# EAGLE board ESP32-P4 Display 10.1 inch V1.1 (EAGLE 9.6.2), part 1 of 4
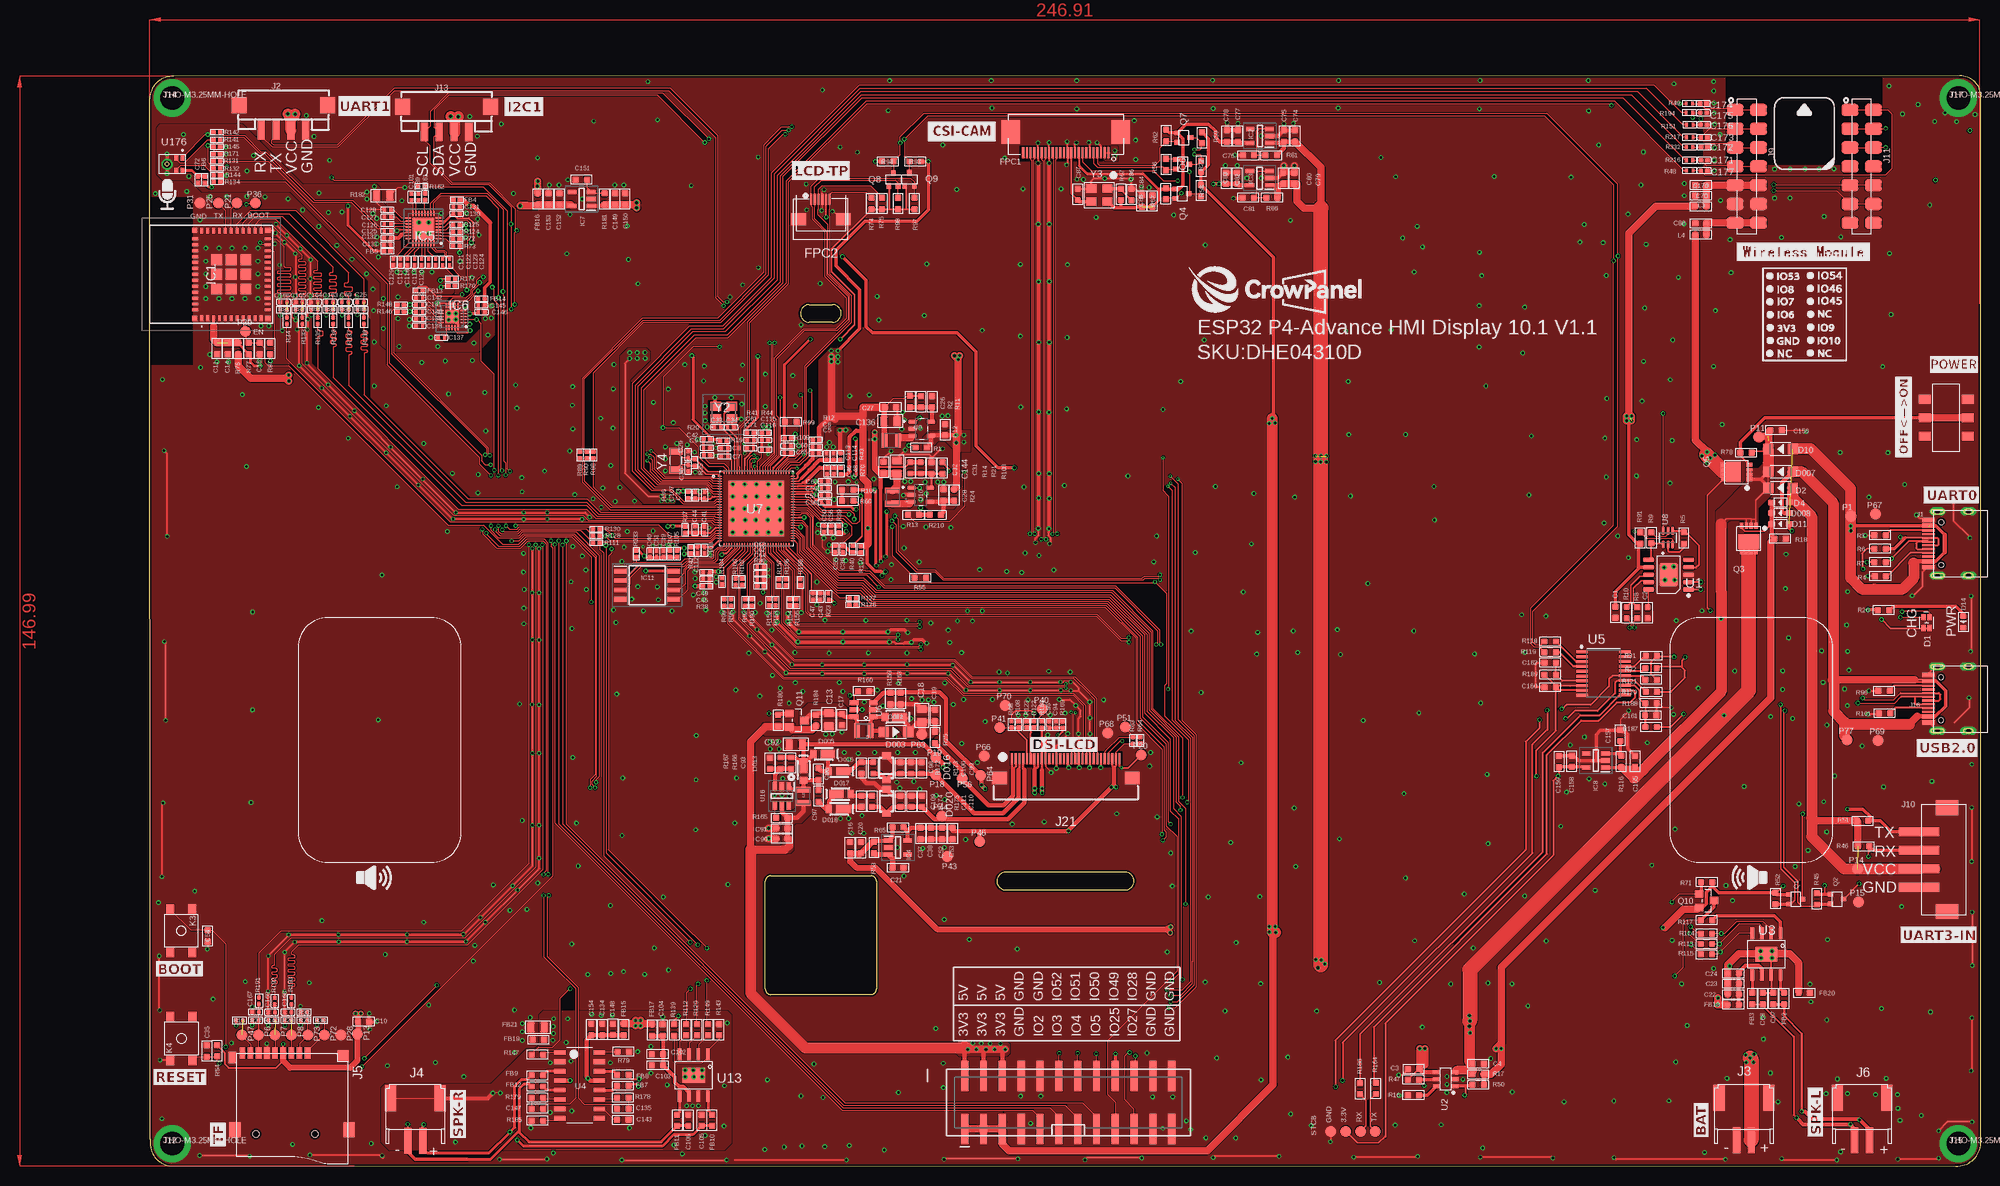
[diagram p10: board, top side]
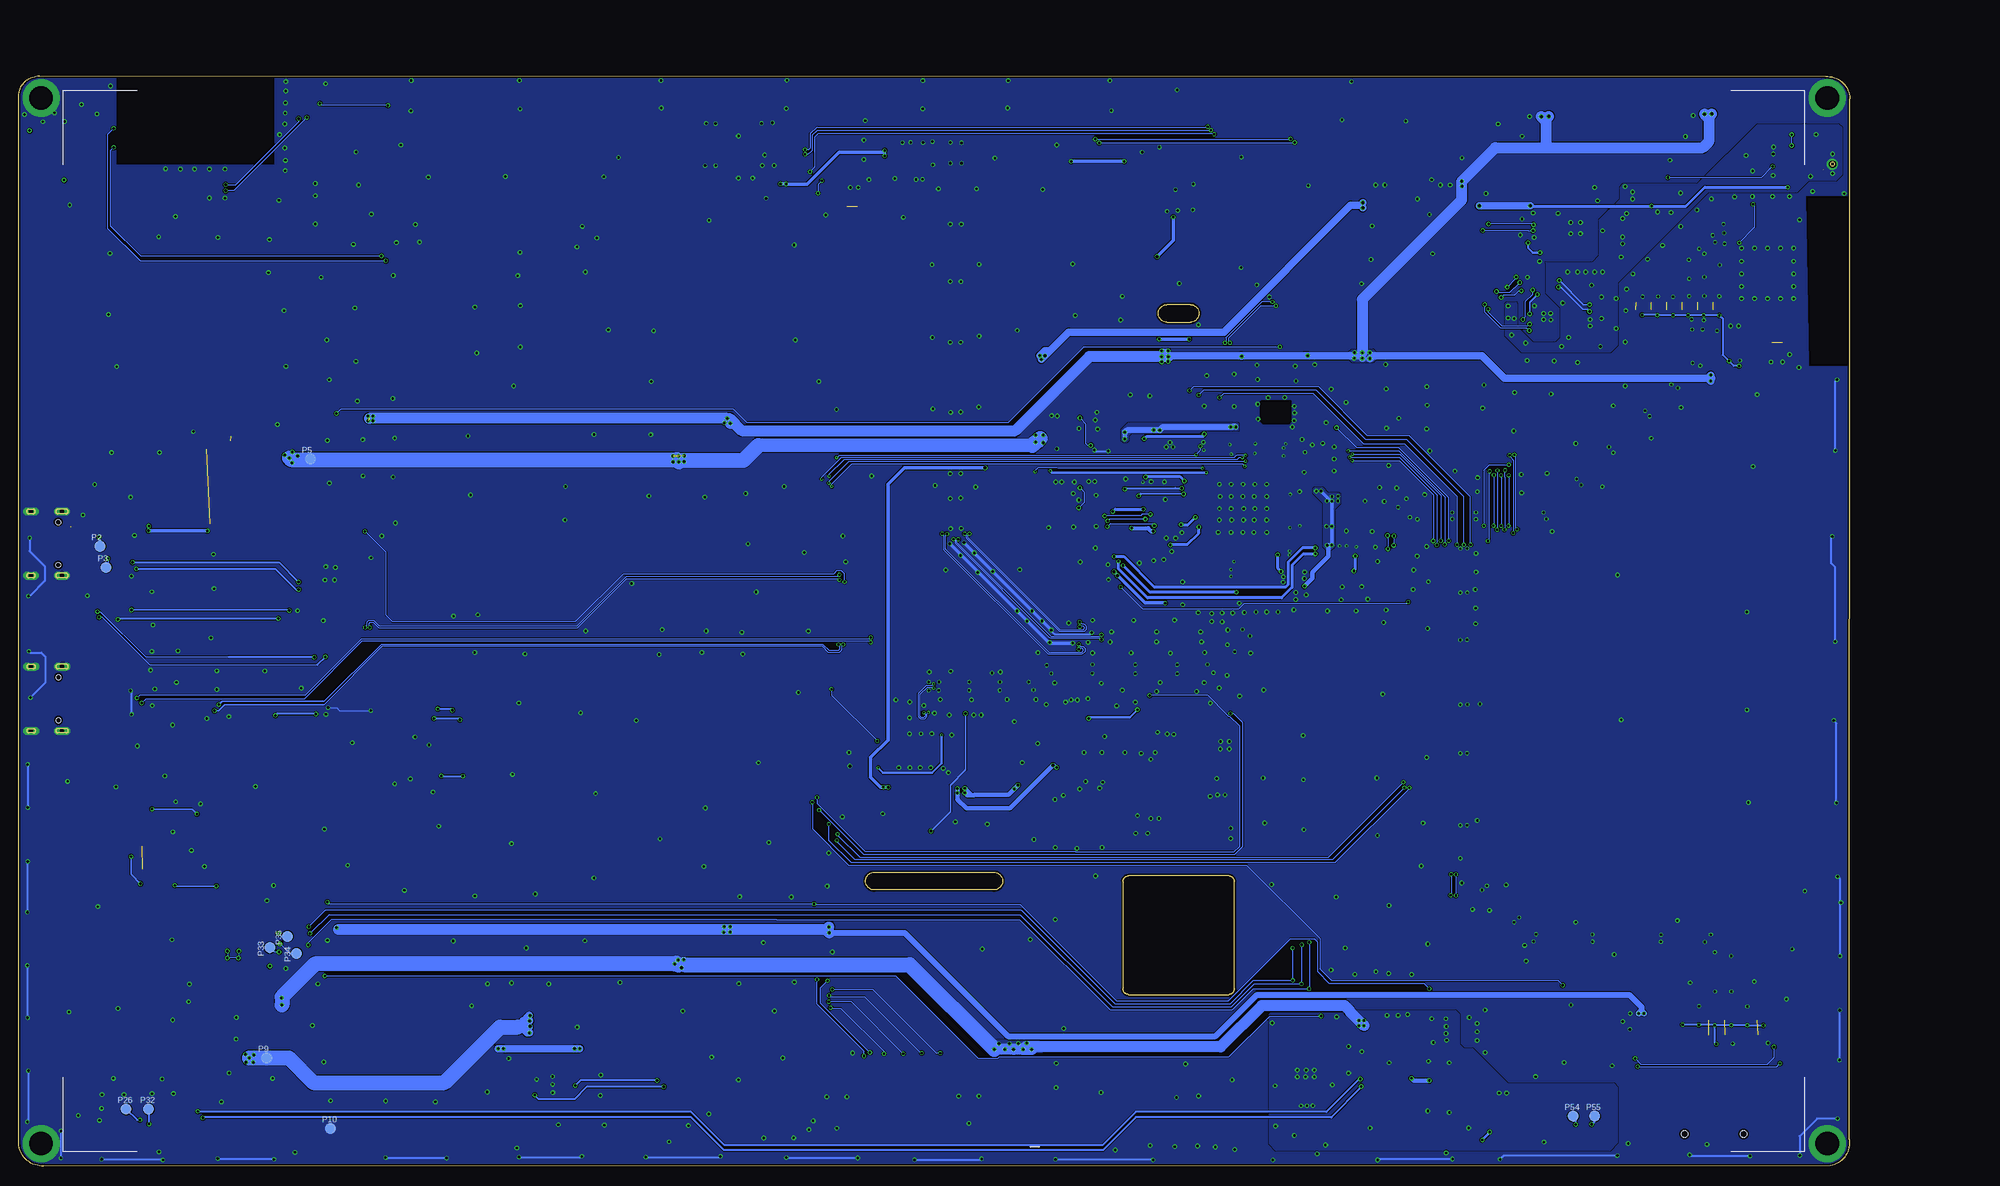
[diagram p11: board, bottom side, seen from below]

Size 247.04 x 147.01 mm. Coordinates in mm from the lower left corner, seen from the top.
Outline: 0.11,3.64 0,143.96 arc-90 3.28,146.96 244.18,147.01 arc-90 247.04,144.29 247.04,3.06 arc-90 243.64,0 2.67,0.03 arc-90 0.11,3.64
Outline: 115.49,37.24 131.61,37.24 arc180 131.61,39.62 115.49,39.62 arc180 115.49,37.24
Outline: 97.3,23.13 83.8,23.13 arc-90 83.05,23.88 83.05,38.38 arc-90 83.8,39.13 97.3,39.13 arc-90 98.05,38.38 98.05,23.88 arc-90 97.3,23.13
Outline: 92.11,113.8 88.99,113.8 arc-180 88.99,116.18 92.11,116.18 arc-180 92.11,113.8
Outline: circle at 2.38,135.11 radius 0.25
Copper layers (1*16): Top 0.035mm / dielectric 1.5mm / Bottom 0.035mm
Design rules "default *": minimum track width 4mil, minimum drill 0.2mm, track to track 4mil, track to pad 5mil, pad to pad 5mil, via to via 5mil, smd to smd 5mil, copper to edge 10mil, drill to drill 5mil, minimum pad ring 10mil, minimum via ring 4mil, stop-mask expansion 4mil, vias tented up to drill 30mil, thermal gap 6mil

## Footprints (pad centres in the part's own frame; a part is rotated, then mirrored left to right if it is on the bottom)
0603 = smd 0.889 x 0.889: 1 -0.762,0; 2 0.762,0
C0402 = smd 0.6 x 0.6: 1 -0.45,0; 2 0.45,0
C0805 = smd 1.016 x 1.397: 1 -0.889,0; 2 0.889,0
C0402' = smd 0.584 x 0.584: 1 -0.45,0; 2 0.45,0
0805 = smd 1.016 x 1.397: 1 -0.889,0; 2 0.889,0
C0402'' = smd 0.635 x 0.635: 1 0,0.445; 2 0,-0.445
LED_KT-0603RYG = smd 0.85 x 0.6: 1 0.725,-0.425; 2 0.725,0.425; 3 -0.725,-0.425; 4 -0.725,0.425
D_SOD123FL = smd 1.397 x 1.397: + -1.651,0; - 1.651,0
D_SOD323 = smd 1 x 0.8: + -1.2,0; - 1.2,0
LMBR140ET1G = smd 2 x 1.1: 1 -0.975,0 | smd 0.9 x 1.1: 2 0.975,0
LED0603 = smd 0.762 x 0.889: + -0.762,0; - 0.762,0
LMSZ5233BT1G = smd 0.91 x 1.22: 1 -1.635,0; 2 1.635,0
L0603 = smd 0.889 x 0.889: 1 -0.762,0; 2 0.762,0
L0402 = smd 0.635 x 0.635: 1 -0.445,0; 2 0.445,0
R0402 = smd 0.635 x 0.635: 1 -0.445,0; 2 0.445,0
L0805 = smd 1.016 x 1.397: 1 -0.889,0; 2 0.889,0
FPC-SMD_P0.50-24P_QCHF-SM-H2.0 = smd 0.3 x 1.5: 1 5.75,-1.574; 2 5.25,-1.574; 3 4.75,-1.574; 4 4.25,-1.574; 5 3.75,-1.574; 6 3.25,-1.574; 7 2.75,-1.574; 8 2.25,-1.574; 9 1.75,-1.574; 10 1.25,-1.574; 11 0.75,-1.574; 12 0.25,-1.574; 13 -0.25,-1.574; 14 -0.75,-1.574; 15 -1.25,-1.574; 16 -1.75,-1.574; 17 -2.25,-1.574; 18 -2.75,-1.574; 19 -3.25,-1.574; 20 -3.75,-1.574; 21 -4.25,-1.574; 22 -4.75,-1.574; 23 -5.25,-1.574; 24 -5.75,-1.574 | smd 2.5 x 3.2: 25 7.4,1.195; 26 -7.4,1.195
FPC-6PIN-0.5MM = smd 0.3 x 1.5: 1 -1.31,2.184; 2 -0.81,2.184; 3 -0.31,2.184; 4 0.19,2.184; 5 0.69,2.184; 6 1.19,2.184 | smd 2 x 1.6: 7 -3.01,-0.496; 8 3.036,-0.496
ESP32C6MINI1N4 = smd 0.8 x 0.4: 1 -5.9,4; 2 -5.9,3.2; 3 -5.9,2.4; 4 -5.9,1.6; 5 -5.9,0.8; 6 -5.9,0; 7 -5.9,-0.8; 8 -5.9,-1.6; 9 -5.9,-2.4; 10 -5.9,-3.2; 11 -5.9,-4; 25 5.9,-4; 26 5.9,-3.2; 27 5.9,-2.4; 28 5.9,-1.6; 29 5.9,-0.8; 30 5.9,0; 31 5.9,0.8; 32 5.9,1.6; 33 5.9,2.4; 34 5.9,3.2; 35 5.9,4 | smd 0.4 x 0.8: 12 -4.8,-4.9; 13 -4,-4.9; 14 -3.2,-4.9; 15 -2.4,-4.9; 16 -1.6,-4.9; 17 -0.8,-4.9; 18 0,-4.9; 19 0.8,-4.9; 20 1.6,-4.9; 21 2.4,-4.9; 22 3.2,-4.9; 23 4,-4.9; 24 4.8,-4.9; 36 4.8,4.9; 37 4,4.9; 38 3.2,4.9; 39 2.4,4.9; 40 1.6,4.9; 41 0.8,4.9; 42 0,4.9; 43 -0.8,4.9; 44 -1.6,4.9; 45 -2.4,4.9; 46 -3.2,4.9; 47 -4,4.9; 48 -4.8,4.9 | smd 1.45 x 1.45: 49 0,0; 54 -1.975,1.975; 55 -1.975,0; 56 -1.975,-1.975; 57 0,-1.975; 58 1.975,-1.975; 59 1.975,0; 60 1.975,1.975; 61 0,1.975 | smd 0.7 x 0.7: 50 5.95,4.95; 51 5.95,-4.95; 52 -5.95,-4.95; 53 -5.95,4.95
SOT95P282X145-5N = smd 1.2 x 0.6: 1 -1.3,0.95; 2 -1.3,0; 3 -1.3,-0.95; 4 1.3,-0.95; 5 1.3,0.95
QFN40P400X400X80-33N = smd 0.75 x 0.2: 1 -2,1.4; 2 -2,1; 3 -2,0.6; 4 -2,0.2; 5 -2,-0.2; 6 -2,-0.6; 7 -2,-1; 8 -2,-1.4; 17 2,-1.4; 18 2,-1; 19 2,-0.6; 20 2,-0.2; 21 2,0.2; 22 2,0.6; 23 2,1; 24 2,1.4 | smd 0.2 x 0.75: 9 -1.4,-2; 10 -1,-2; 11 -0.6,-2; 12 -0.2,-2; 13 0.2,-2; 14 0.6,-2; 15 1,-2; 16 1.4,-2; 25 1.4,2; 26 1,2; 27 0.6,2; 28 0.2,2; 29 -0.2,2; 30 -0.6,2; 31 -1,2; 32 -1.4,2 | smd 2.9 x 2.9: 33 0,0
QFN40P300X300X60-21N = smd 0.75 x 0.2: 1 -1.5,0.8; 2 -1.5,0.4; 3 -1.5,0; 4 -1.5,-0.4; 5 -1.5,-0.8; 11 1.5,-0.8; 12 1.5,-0.4; 13 1.5,0; 14 1.5,0.4; 15 1.5,0.8 | smd 0.2 x 0.75: 6 -0.8,-1.5; 7 -0.4,-1.5; 8 0,-1.5; 9 0.4,-1.5; 10 0.8,-1.5; 16 0.8,1.5; 17 0.4,1.5; 18 0,1.5; 19 -0.4,1.5; 20 -0.8,1.5 | smd 1.8 x 1.8: 21 0,0
SOIC127P790X216-8N = smd 1.65 x 0.65: 1 -3.6,1.905; 2 -3.6,0.635; 3 -3.6,-0.635; 4 -3.6,-1.905; 5 3.6,-1.905; 6 3.6,-0.635; 7 3.6,0.635; 8 3.6,1.905
USB-3.0TYPEC-SMD = smd 0.3 x 1.7: A1 -3.35,0.5; A4 -2.55,0.5; A5 -1.25,0.5; A6 -0.25,0.5; A7 0.25,0.5; A8 1.25,0.5; A9 2.55,0.5; A12 3.35,0.5; B1 3.05,0.5; B4 2.25,0.5; B5 1.75,0.5; B6 0.75,0.5; B7 -0.75,0.5; B8 -1.75,0.5; B9 -2.25,0.5; B12 -3.05,0.5 | drill 0.6 pad 1.016 long: P$1 -4.325,-0.72; P$2 4.325,-0.72; P$3 -4.325,-4.9; P$4 4.325,-4.9 | hole 0.68: -2.89,-1.22; 2.89,-1.22
CONNECTOR_4P-SMD-2.0 = smd 0.965 x 2.54: 1 -3,0; 2 -1,0; 3 1,0; 4 3,0 | smd 2.032 x 2.184: SS1 -5.946,3.4; SS2 5.946,3.4
PH2.0WT-2PIN = smd 1 x 3.5: P$1 -1,0; P$2 1,0 | smd 1.5 x 3.5: P$3 -3.35,-5.7; P$4 3.35,-5.7
9P-SMD-W/-RING = smd 1.524 x 0.762: 1 0,4.4; 2 0,3.3; 3 0,2.2; 4 0,1.1; 5 0,0; 6 0,-1.1; 7 0,-2.2; 8 0,-3.3; 9 0,-4.4 | smd 1.524 x 1.016: G1 0.6,-5.746 | smd 2.032 x 1.524: G2 10.373,-5.4; G3 10.373,10 | smd 1.524 x 1.524: G4 0.392,9.181 | hole 0.889: 10.9,-2.6; 10.9,5.4
2X12-SMD1 = smd 4.14 x 0.991: 1 -3.569,13.97; 2 3.569,13.97; 3 -3.569,11.43; 4 3.569,11.43; 5 -3.569,8.89; 6 3.569,8.89; 7 -3.569,6.35; 8 3.569,6.35; 9 -3.569,3.81; 10 3.569,3.81; 11 -3.569,1.27; 12 3.569,1.27; 13 -3.569,-1.27; 14 3.569,-1.27; 15 -3.569,-3.81; 16 3.569,-3.81; 17 -3.569,-6.35; 18 3.569,-6.35; 19 -3.569,-8.89; 20 3.569,-8.89; 21 -3.569,-11.43; 22 3.569,-11.43; 23 -3.569,-13.97; 24 3.569,-13.97
TEST-PIN-4-2.0MM = smd 1.5 x 1.5: 1 -3,0; 2 -1,0; 3 1,0; 4 3,0
H7-2.54-18.28X2.5X5MM = smd 1.65 x 2.3: 1 -7.62,-1.58; 1-1 -7.62,1.58; 2 -5.08,-1.58; 2-2 -5.08,1.58; 3 -2.54,-1.58; 3-3 -2.54,1.58; 4 0,-1.58; 4-4 0,1.58; 5 2.54,-1.58; 5-5 2.54,1.58; 6 5.08,-1.58; 6-6 5.08,1.58; 7 7.62,-1.58; 7-7 7.62,1.58
XH2.54-4P-SMD = smd 1.2 x 5.5: 1 -3.75,-1.875; 2 -1.25,-1.875; 3 1.25,-1.875; 4 3.75,-1.875 | smd 2 x 3: 5 -7,1.875; 6 7,1.875
THO-M3.2*5MM-HOLE = drill 3.2 pad 5: P$1 0,0
C23398852_30P_0.5MM_下接_FC-05A30P11H20 = smd 0.3 x 1.5: 1 -7.25,1.3; 2 -6.75,1.3; 3 -6.25,1.3; 4 -5.75,1.3; 5 -5.25,1.3; 6 -4.75,1.3; 7 -4.25,1.3; 8 -3.75,1.3; 9 -3.25,1.3; 10 -2.75,1.3; 11 -2.25,1.3; 12 -1.75,1.3; 13 -1.25,1.3; 14 -0.75,1.3; 15 -0.25,1.3; 16 0.25,1.3; 17 0.75,1.3; 18 1.25,1.3; 19 1.75,1.3; 20 2.25,1.3; 21 2.75,1.3; 22 3.25,1.3; 23 3.75,1.3; 24 4.25,1.3; 25 4.75,1.3; 26 5.25,1.3; 27 5.75,1.3; 28 6.25,1.3; 29 6.75,1.3; 30 7.25,1.3 | smd 2 x 1.7: 31 8.95,-1.3; 32 -8.95,-1.3
KEY-4.5X4.5-SMD = smd 1.35 x 1.1: 1 -2.925,1.5; 2 -2.925,-1.5; 3 2.925,-1.5; 4 2.925,1.5
1008(2520) = smd 0.8 x 2: 1 -0.9,0; 2 0.9,0
TEST_PAD-1.5MM = smd 1.5 x 1.5: P$1 0,0
MOS_SOT323 = smd 0.635 x 0.762: 1 -0.635,-0.889; 2 0.635,-0.889; 3 0,0.889
PDFN3333 = smd 0.5 x 0.8: 1 -0.975,-1.725; 2 -0.325,-1.725; 4 0.975,-1.725; 5 0.975,1.725; 6 0.325,1.725; 7 -0.325,1.725; 8 -0.975,1.725 | smd 0.4 x 0.8: 3 0.325,-1.725 | smd 2.8 x 2: 9 0,0.4
PMOS_SOT23 = smd 1.016 x 1.143: 1 -0.889,-1.016; 2 0.889,-1.016; 3 0,1.016
R0603@1 = smd 0.889 x 0.889: 1 -0.762,0; 2 0.762,0
R0603 = smd 0.889 x 0.889: 1 -0.762,0; 2 0.762,0
R0402' = smd 0.584 x 0.584: 1 -0.445,0; 2 0.445,0
R0603-SP = smd 0.889 x 0.889: 1 -0.762,0; 2 0.762,0
0402 = smd 0.5 x 0.5: 1 -0.45,0; 2 0.45,0
R0805 = smd 1.016 x 1.397: 1 -0.889,0; 2 0.889,0
SWITCH_6PIN_2P = smd 1.2 x 1.6: 1 2.5,-2.9; 2 0,-2.9; 3 -2.5,-2.9; 4 -2.5,2.9; 5 0,2.9; 6 2.5,2.9
ESOP-10-EP-150MIL = smd 1.5 x 0.6: 1 -2.7,2; 2 -2.7,1; 3 -2.7,0; 4 -2.7,-1; 5 -2.7,-2; 6 2.7,-2; 7 2.7,-1; 8 2.7,0; 9 2.7,1; 10 2.7,2 | smd 2.4 x 3.2: EP 0,0
SOT23-6L = smd 0.5 x 0.9: 1 -0.961,-1.212; 2 -0.011,-1.212; 3 0.94,-1.212; 4 0.94,1.288; 5 -0.011,1.288; 6 -0.961,1.288
NS4168-ESOP-8 = smd 1.6 x 0.5: 1 -2.8,1.905; 2 -2.8,0.635; 3 -2.8,-0.635; 4 -2.8,-1.905; 5 2.8,-1.905; 6 2.8,-0.635; 7 2.8,0.635; 8 2.8,1.905 | smd 2 x 3: 9 0,0
SOP16 = smd 0.635 x 1.524: 1 0,0; 2 1.27,0; 3 2.54,0; 4 3.81,0; 5 5.08,0; 6 6.35,0; 7 7.62,0; 8 8.89,0; 9 8.89,5.334; 10 7.62,5.334; 11 6.35,5.334; 12 5.08,5.334; 13 3.81,5.334; 14 2.54,5.334; 15 1.27,5.334; 16 0,5.334
TSSOP20 = smd 1.572 x 0.41: 1 -2.872,2.275; 2 -2.872,1.625; 3 -2.872,0.975; 4 -2.872,0.325; 5 -2.872,-0.325; 6 -2.872,-0.975; 7 -2.872,-1.625; 8 -2.872,-2.275; 9 -2.872,-2.895; 10 -2.872,-3.545; 11 2.872,-3.515; 12 2.872,-2.865; 13 2.872,-2.215; 14 2.872,-1.565; 15 2.872,-0.915; 16 2.872,-0.265; 17 2.872,0.355; 18 2.872,1.005; 19 2.872,1.625; 20 2.872,2.275
COOPER_SOT23-6 = smd 0.69 x 1.2: 1 -0.95,-1.3; 2 0,-1.3; 3 0.95,-1.3; 4 0.95,1.3; 5 0,1.3; 6 -0.95,1.3
IC_ESP32-P4NRW32 = smd 0.65 x 0.18: 1 -4.925,4.375; 2 -4.925,4.025; 3 -4.925,3.675; 4 -4.925,3.325; 5 -4.925,2.975; 6 -4.925,2.625; 7 -4.925,2.275; 8 -4.925,1.925; 9 -4.925,1.575; 10 -4.925,1.225; 11 -4.925,0.875; 12 -4.925,0.525; 13 -4.925,0.175; 14 -4.925,-0.175; 15 -4.925,-0.525; 16 -4.925,-0.875; 17 -4.925,-1.225; 18 -4.925,-1.575; 19 -4.925,-1.925; 20 -4.925,-2.275; 21 -4.925,-2.625; 22 -4.925,-2.975; 23 -4.925,-3.325; 24 -4.925,-3.675; 25 -4.925,-4.025; 26 -4.925,-4.375; 53 4.925,-4.375; 54 4.925,-4.025; 55 4.925,-3.675; 56 4.925,-3.325; 57 4.925,-2.975; 58 4.925,-2.625; 59 4.925,-2.275; 60 4.925,-1.925; 61 4.925,-1.575; 62 4.925,-1.225; 63 4.925,-0.875; 64 4.925,-0.525; 65 4.925,-0.175; 66 4.925,0.175; 67 4.925,0.525; 68 4.925,0.875; 69 4.925,1.225; 70 4.925,1.575; 71 4.925,1.925; 72 4.925,2.275; 73 4.925,2.625; 74 4.925,2.975; 75 4.925,3.325; 76 4.925,3.675; 77 4.925,4.025; 78 4.925,4.375 | smd 0.18 x 0.65: 27 -4.375,-4.925; 28 -4.025,-4.925; 29 -3.675,-4.925; 30 -3.325,-4.925; 31 -2.975,-4.925; 32 -2.625,-4.925; 33 -2.275,-4.925; 34 -1.925,-4.925; 35 -1.575,-4.925; 36 -1.225,-4.925; 37 -0.875,-4.925; 38 -0.525,-4.925; 39 -0.175,-4.925; 40 0.175,-4.925; 41 0.525,-4.925; 42 0.875,-4.925; 43 1.225,-4.925; 44 1.575,-4.925; 45 1.925,-4.925; 46 2.275,-4.925; 47 2.625,-4.925; 48 2.975,-4.925; 49 3.325,-4.925; 50 3.675,-4.925; 51 4.025,-4.925; 52 4.375,-4.925; 79 4.375,4.925; 80 4.025,4.925; 81 3.675,4.925; 82 3.325,4.925; 83 2.975,4.925; 84 2.625,4.925; 85 2.275,4.925; 86 1.925,4.925; 87 1.575,4.925; 88 1.225,4.925; 89 0.875,4.925; 90 0.525,4.925; 91 0.175,4.925; 92 -0.175,4.925; 93 -0.525,4.925; 94 -0.875,4.925; 95 -1.225,4.925; 96 -1.575,4.925; 97 -1.925,4.925; 98 -2.275,4.925; 99 -2.625,4.925; 100 -2.975,4.925; 101 -3.325,4.925; 102 -3.675,4.925; 103 -4.025,4.925; 104 -4.375,4.925 | smd 7.5 x 7.5: 105 0,0
SOP65P210X100-6N = smd 1.09 x 0.4: 1 -0.92,0.65; 2 -0.92,0; 3 -0.92,-0.65; 4 0.92,-0.65; 5 0.92,0; 6 0.92,0.65
SOT95P280X145-5N = smd 1.21 x 0.59: 1 -1.255,0.95; 2 -1.255,0; 3 -1.255,-0.95; 4 1.255,-0.95; 5 1.255,0.95
SOT95P280X145-6N = smd 1.2 x 0.6: 1 -1.25,0.95; 2 -1.25,0; 3 -1.25,-0.95; 4 1.25,-0.95; 5 1.25,0; 6 1.25,0.95
BRAIN1_MIC-SMD_5P-L3.5-W2.7 = smd 0.725 x 0.522: 1 -0.838,1.362; 2 -0.838,0.542; 3 0.838,0.542; 4 0.838,1.362 | drill 1: P$1 0.013,-0.711
X322540MPB4SI = smd 1.4 x 1.2: 1 -1.1,-0.85; 2 1.1,-0.85; 3 1.1,0.85; 4 -1.1,0.85
24MHZ_1631-24003-BTKEYA = smd 1.4 x 1.2: 1 -1.1,-0.875; 2 1.1,-0.875; 3 1.1,0.875; 4 -1.1,0.875
NORDIC_NRF_XTAL_3215_N = smd 1 x 1.8: 1 -1.25,0; 2 1.25,0

## Placement (x,y rotation side)
C1  1uF  [0603]  197.74,74.68 90 top
C2  1uF  [0603]  202.07,74.62 90 top
C3  1uF  [0603]  170.5,13.08 0 top
C4  10uF/NC  [0603]  179.2,13.79 180 top
C5  100nF  [C0402]  89.87,96.11 0 top
C6  10uF  [C0402]  89.88,97.01 180 top
C7  100nF  [C0402]  77.55,95.69 180 top
C8  10uF  [C0402]  77.55,96.78 0 top
C9  100nF  [C0402]  75.21,95.83 0 top
C10  1uF  [0603]  28.88,19.47 180 top
C11  100nF  [0603]  9.1,110.26 270 top
C12  10uF/10V+  [0603]  107.31,99.29 90 top
C13  22uF  [C0805]  91.64,60.2 270 top
C14  10uF  [0603]  10.53,110.26 90 top
C15  100nF  [0603]  14.83,110.26 270 top
C16  10uF  [0603]  94.48,42.94 270 top
C17  1uF  [0603]  93.39,60.2 90 top
C18  22uF  [C0805]  104.18,60.74 90 top
C19  100nF  [0603]  105.97,60.77 90 top
C20  100nF  [0603]  95.95,42.94 270 top
C21  100nF  [0603]  100.97,40.22 180 top
C22  1uF_NC  [0603]  213.62,23.16 180 top
C23  47uF_NC  [0603]  213.62,24.59 180 top
C24  47uF_NC  [0603]  213.62,25.99 180 top
C25  22pF  [C0402']  28.46,116.5 180 top
C26  22pF  [0603]  102.6,103.09 90 top
C27  10uF/10V+  [0603]  99.96,102.34 180 top
C28  10uF/10V+  [0603]  107.11,90.49 90 top
C29  12pF  [C0402]  72.64,95.94 90 top
C30  12pF  [C0402]  72.65,94.11 270 top
C31  22pF  [0603]  102.62,94.16 90 top
C32  10uF/10V+  [0603]  99.03,94.24 270 top
C33  15pF  [C0402]  76.59,99.63 180 top
C34  15pF  [C0402]  78.43,99.63 180 top
C35  100nF  [0603]  7.74,15.51 270 top
C36  100nF  [C0402]  93.52,83.18 270 top
C37  100nF  [0603]  104.01,44.85 90 top
C38  10uF  [0603]  105.44,44.85 90 top
C39  100nF_NC  [C0402]  69.29,82.57 90 top
C40  100nF  [C0402]  67.49,82.57 90 top
C41  100nF  [C0402]  74.87,85.82 90 top
C42  10uF  [C0402]  75.19,96.85 180 top
C43  100nF  [C0402]  90.5,76.81 270 top
C44  10uF  [C0402]  73.56,85.85 270 top
C45  100nF  [C0402]  75.11,79.17 180 top
C46  100nF  [C0402]  91.39,93.73 270 top
C47  10uF  [C0402]  89.5,76.8 90 top
C48  10uF  [C0402]  92.33,93.73 90 top
C49  10uF  [C0402]  75.11,80.09 0 top
C50  100nF  [C0402]  90.98,85.91 270 top
C51  1uF  [C0402]  68.39,82.57 90 top
C52  100nF  [0603]  106.89,44.85 90 top
C53  100nF  [0603]  108.32,44.85 90 top
C54  100nF  [0603]  7.83,31.03 90 top
C55  1uF  [C0402]  92.5,83.19 270 top
C56  10uF  [C0402]  91.98,85.91 90 top
C57  1uF  [C0402]  91.1,90.47 0 top
C58  1uF  [C0402]  91.1,89.51 0 top
C59  1uF  [C0402]  91.1,91.41 0 top
C60  100nF  [C0402]  86.08,97.12 0 top
C61  100nF  [C0402]  81.05,97.88 180 top
C62  10nF  [C0402]  82.41,79.92 0 top
C63  100nF  [C0402]  82.4,80.79 0 top
C64  1uF  [C0402]  82.39,79.09 0 top
C65  1uF  [C0402]  86.08,96.2 0 top
C66  1uF  [C0402]  91.1,92.33 0 top
C67  1nF  [0603]  219.03,22.59 270 top
C68  1nF  [0603]  217.61,22.59 270 top
C69  22pF  [C0402']  26.39,116.5 180 top
C70  10UF  [0603]  209.26,130.85 180 top
C71  10uF  [C0402]  81.03,96.79 0 top
C72  100nF  [C0402]  6.54,133 90 top
C73  100nF  [C0402]  74.87,90.5 90 top
C74  10uF  [0603]  154.52,138.92 270 top
C75  100nF  [0603]  153.05,138.92 270 top
C76  100nF  [0603]  148.23,136.3 0 top
C77  100nF  [0603]  146.81,138.92 270 top
C78  10uF  [0603]  145.32,138.92 270 top
C79  10uF  [0603]  154.42,133.22 270 top
C80  100nF  [0603]  152.91,133.22 270 top
C81  100nF  [0603]  148.2,130.6 0 top
C82  100nF  [0603]  146.72,133.22 270 top
C83  10uF  [0603]  145.22,133.22 270 top
C84  100nF  [0603]  133.85,130.13 270 top
C85  1nF  [0603]  135.28,130.16 270 top
C86  1uF  [0603]  132.46,131.03 270 top
C87  15pF  [0603]  125.2,131.04 270 top
C88  10UF_NC  [0603]  209.26,127.12 180 top
C89  22pF  [C0402]  36.27,130.7 90 top
C90  10uF/25V  [0603]  85.28,44.17 180 top
C91  100nF/50V  [0603]  85.28,45.55 180 top
C92  22uF/16V  [C0805]  87.17,56.88 180 top
C93  10nF/25V  [0603]  86.52,54.34 270 top
C94  10uF/25V  [C0402]  122.29,59.54 90 top
C95  100nF/50V  [C0402]  121.38,59.54 90 top
C96  1uF/25V  [0603]  90.23,52.86 90 top
C97  1uF/25V  [0603]  90.24,49.9 270 top
C98  1uF/50V  [0603]  96.02,53.7 270 top
C99  10uF/25V  [0603]  104.16,53.7 90 top
C100  100nF/50V  [0603]  102.74,53.7 90 top
C101  22pF  [C0402]  35.32,130.7 90 top
C102  1uF_NC  [0603]  68.52,15.09 180 top
C103  47uF_NC  [0603]  68.52,13.59 180 top
C104  47uF_NC  [0603]  69.21,18.36 90 top
C105  1nF  [0603]  74.47,6.18 270 top
C106  1nF  [0603]  72.68,6.18 270 top
C107  10uF  [C0402]  73.65,90.5 270 top
C108  100nF  [C0402]  74.87,83.04 270 top
C109  1uF/50V  [0603]  96.03,49.19 270 top
C110  10uF/25V  [0603]  104.2,49.19 90 top
C111  100nF/50V  [0603]  102.8,49.19 90 top
C112  10uF  [C0402]  73.92,83.04 90 top
C113  100nF  [C0402]  91.33,95.68 90 top
C114  10uF  [C0402]  92.26,95.68 270 top
C115  100nF  [C0402]  83.02,97.91 0 top
C116  10uF  [C0402]  83.03,96.63 180 top
C117  1uF  [C0402]  33.86,121.9 90 top
C118  1uF  [C0402]  34.81,121.9 90 top
C119  1uF  [C0402]  35.75,121.9 90 top
C120  1uF  [C0402]  36.7,121.9 90 top
C121  1uF  [C0402]  37.64,121.9 90 top
C122  1uF  [C0402]  38.59,121.9 90 top
C123  1uF  [C0402]  39.53,121.9 90 top
C124  1uF  [C0402]  40.48,121.9 90 top
C125  1uF  [C0402]  32.09,126.1 180 top
C126  1uF  [C0402]  32.09,127.04 180 top
C127  1uF  [C0402]  32.09,127.99 180 top
C128  1uF  [C0402]  32.09,128.93 180 top
C129  1uF  [C0402]  32.91,121.89 270 top
C130  100nF  [C0402]  41.42,128.41 0 top
C131  1uF  [C0402]  41.43,129.36 180 top
C132  100nF  [C0402]  32.09,125.16 180 top
C133  1uF  [C0402]  32.08,124.25 0 top
C134  47uF  [0603]  61.09,18.42 270 top
C135  100nF  [0603]  63.85,7.73 0 top
C136  22uF  [0805]  99.94,100.47 180 top
C137  1uF  [C0402]  39.37,111.72 0 top
C138  1uF  [C0402]  36.38,113.33 180 top
C139  1uF  [C0402]  36.38,114.28 180 top
C140  1uF  [C0402]  36.38,115.22 180 top
C141  1uF  [C0402]  36.38,116.17 180 top
C142  1uF  [C0402]  36.38,117.11 180 top
C143  1uF  [0603]  63.85,6.23 180 top
C144  22uF  [0805]  100.81,94.24 270 top
C145  100nF  [C0402]  44.77,116.06 0 top
C146  1uF  [C0402]  44.78,115.15 180 top
C147  100nF  [0603]  52.31,7.75 180 top
C148  47uF  [0603]  62.5,18.44 270 top
C149  10uF  [0603]  62.8,130.42 270 top
C150  100nF  [0603]  64.14,130.42 270 top
C151  100nF  [0603]  58.25,133.01 0 top
C152  100nF  [0603]  55.29,130.42 270 top
C153  10uF  [0603]  53.83,130.42 270 top
C154  100nF  [0603]  59.6,18.42 90 top
C155  10uF  [0603]  200.37,54.59 270 top
C156  100nF  [0603]  219.39,99.24 180 top
C157  100nF  [0603]  198.37,58.08 270 top
C158  100nF  [0603]  191.84,54.59 270 top
C159  10uF  [0603]  190.11,54.54 270 top
C160  1uF  [0603]  188.91,64.57 0 top
C161  1nF  [0603]  202.5,60.8 180 top
C162  100nF  [0603]  188.91,67.89 0 top
C163  22pF  [C0402']  24.31,116.5 180 top
C164  22pF  [C0402']  22.24,116.5 180 top
C165  22pF  [C0402']  20.16,116.5 180 top
C166  22pF  [C0402']  18.08,116.5 180 top
C167  22pF  [C0402']  14.3,20.77 180 top
C168  22pF  [C0402']  18.68,20.75 180 top
C169  22pF  [C0402']  16.46,20.73 180 top
C170  100nF  [0603]  209.25,132.28 180 top
C171  NC  [C0402'']  209.71,135.64 270 top
C172  NC  [C0402'']  209.71,137.42 270 top
C173  NC  [C0402'']  209.7,138.73 270 top
C174  NC  [C0402'']  209.59,143.27 270 top
C175  NC  [C0402'']  209.62,142.04 270 top
C176  NC  [C0402'']  209.67,140.42 270 top
C177  NC  [C0402'']  209.7,134.23 270 top
D1  KT-0603RYG  [LED_KT-0603RYG]  239.7,73.28 270 top
D2  DSS34  [D_SOD123FL]  220,91.45 180 top
D003  NC/DSS34  [D_SOD123FL]  100.7,58.54 0 top
D4  1N5817WS  [D_SOD323]  220,89.5 180 top
D005  LMBR140ET1G  [LMBR140ET1G]  90.52,55.57 180 top
D007  DSS34  [D_SOD123FL]  220,93.63 180 top
D008  1N5817WS  [D_SOD323]  220,88.05 180 top
D10  DSS34  [D_SOD123FL]  220,96.68 180 top
D11  1N5817WS  [D_SOD323]  220,86.6 180 top
D012  LMBR140ET1G  [LMBR140ET1G]  100.2,60.57 180 top
D013  LMBR140ET1G  [LMBR140ET1G]  88.22,53.01 270 top
D14  Red  [LED0603]  244.66,73.37 270 top
D015  LMBR140ET1G  [LMBR140ET1G]  92.62,53.24 180 top
D016  MM1W18_18V  [LMSZ5233BT1G]  99.42,53.7 90 top
D017  LMBR140ET1G  [LMBR140ET1G]  93.62,50.17 0 top
D018  LMBR140ET1G  [LMBR140ET1G]  92.62,48.15 180 top
D020  LMSZ5233BT1G_-6V  [LMSZ5233BT1G]  99.4,49.19 270 top
FB2  1K/磁珠_NC  [L0603]  220.48,22.59 270 top
FB3  1K/磁珠_NC  [L0603]  216.2,22.59 270 top
FB4  0R/800mA  [L0402]  41.44,130.29 180 top
FB5  0R/800mA  [L0402]  32.06,123.35 0 top
FB6  0R/800mA  [L0402]  7.46,133 90 top
FB7  1K/磁珠  [L0603]  63.85,10.83 0 top
FB8  1K/磁珠  [L0603]  63.85,12.33 0 top
FB9  1K/磁珠  [L0603]  52.3,12.23 180 top
FB10  1K/磁珠_NC  [L0603]  75.87,6.18 270 top
FB11  1K/磁珠_NC  [L0603]  71.18,6.18 270 top
FB12  1K/磁珠  [L0603]  52.3,10.73 180 top
FB13  0R/800mA  [L0402]  36.39,118.07 180 top
FB14  0R/800mA  [R0402]  44.76,116.97 180 top
FB15  0R/2A  [L0603]  63.97,18.42 270 top
FB16  0R/800mA_NC  [L0603]  52.35,130.42 270 top
FB17  0R/2A  [L0603]  67.79,18.36 90 top
FB18  0R/2A  [L0603]  213.62,21.78 180 top
FB19  0R/2A  [L0603]  52.45,17.03 0 top
FB20  0R/2A  [L0603]  223.2,23.35 180 top
FB21  0R/2A  [L0805]  52.35,18.73 0 top
FPC1  AFC24-S24FIA-00  [FPC-SMD_P0.50-24P_QCHF-SM-H2.0]  123.59,138.24 0 top
FPC2  FPC-6PIN-0.5MM  [FPC-6PIN-0.5MM]  90.55,128.18 0 top
IC1  ESP32-C6-MINI-1-N4  [ESP32C6MINI1N4]  11.03,120.25 90 top
IC2  ME6211C18M5G-N  [SOT95P282X145-5N]  149.77,138.92 180 top
IC3  ME6211C28M5G-N  [SOT95P282X145-5N]  149.76,133.22 180 top
IC4  ME6211C18M5G-N_NC  [SOT95P282X145-5N]  100.97,42.95 0 top
IC5  ES7210  [QFN40P400X400X80-33N]  36.94,126.46 180 top
IC6  ES8311  [QFN40P300X300X60-21N]  40.81,114.56 180 top
IC7  ME6211C33M5G-N  [SOT95P282X145-5N]  58.28,130.42 180 top
IC8  ME6211C33M5G-N  [SOT95P282X145-5N]  195.08,54.68 180 top
IC11  W25Q128JVSIQ  [SOIC127P790X216-8N]  67.11,78.32 0 top
J1  TYPEC-3.0-16P-SMD  [USB-3.0TYPEC-SMD]  240.47,83.95 90 top
J2  HY2.0-4P-SMT  [CONNECTOR_4P-SMD-2.0]  18.07,139.67 0 top
J3  PH2.0WT-2PIN  [PH2.0WT-2PIN]  215.07,3.49 180 top
J4  PH2.0WT-2PIN  [PH2.0WT-2PIN]  35.85,3.44 180 top
J5  [9P-SMD-W/-RING]  16.93,15.24 270 top
J6  PH2.0WT-2PIN  [PH2.0WT-2PIN]  230.99,3.49 180 top
J7  CONN_12X22X12-SMD1  [2X12-SMD1]  123.93,8.57 90 top
J8  HC-PZ200-8.7L-1X4PZ1  [TEST-PIN-4-2.0MM]  162.36,4.68 180 top
J9  [H7-2.54-18.28X2.5X5MM]  215.46,134.81 270 top
J10  XH2.54-4P-SMT  [XH2.54-4P-SMD]  240.58,41.32 270 top
J11  [H7-2.54-18.28X2.5X5MM]  230.96,134.81 270 top
J12  THO-M3.25MM-HOLE  [THO-M3.2*5MM-HOLE]  3.05,3.03 0 top
J13  HY2.0-4P-SMT  [CONNECTOR_4P-SMD-2.0]  40.07,139.45 0 top
J14  THO-M3.25MM-HOLE  [THO-M3.2*5MM-HOLE]  3.05,144.03 0 top
J15  THO-M3.25MM-HOLE  [THO-M3.2*5MM-HOLE]  244,3.03 0 top
J16  TYPEC-3.0-16P-SMD  [USB-3.0TYPEC-SMD]  240.44,63.02 90 top
J17  THO-M3.25MM-HOLE  [THO-M3.2*5MM-HOLE]  244,144.03 0 top
J21  C23398852_30P_0.5MM_下接_FC-05A30P11H20  [C23398852_30P_0.5MM_下接_FC-05A30P11H20]  123.6,53.64 0 top
K3  KEY-4.5X4.5  [KEY-4.5X4.5-SMD]  4.27,31.73 270 top
K4  KEY-4.5X4.5  [KEY-4.5X4.5-SMD]  4.3,17.22 90 top
L1  2.2μH_C5179446  [1008(2520)]  100.06,97.84 180 top
L2  4.7uH_C45385206_2.4A  [1008(2520)]  88.19,49.86 90 top
L3  0R  [L0603]  209.24,129.42 180 top
L4  NC  [L0603]  209.26,125.6 180 top
L5  4.7uH_C45385206_2.4A  [1008(2520)]  96.33,58.69 0 top
L6  2.2μH_C5179446  [1008(2520)]  100.24,90.2 90 top
P1  TEST_PADPAD-1.5MM  [TEST_PAD-1.5MM]  229.49,87.63 0 top
P2  TEST_PADPAD-1.5MM  [TEST_PAD-1.5MM]  236.06,83.58 0 bottom
P3  TEST_PADPAD-1.5MM  [TEST_PAD-1.5MM]  235.23,80.74 0 bottom
P5  TEST_PADPAD-1.5MM  [TEST_PAD-1.5MM]  207.68,95.34 0 bottom
P6  TEST_PADPAD-1.5MM  [TEST_PAD-1.5MM]  14.68,17.68 270 top
P7  TEST_PADPAD-1.5MM  [TEST_PAD-1.5MM]  16.91,17.68 270 top
P8  TEST_PADPAD-1.5MM  [TEST_PAD-1.5MM]  19.13,17.66 270 top
P9  TEST_PADPAD-1.5MM  [TEST_PAD-1.5MM]  213.57,14.6 0 bottom
P10  TEST_PADPAD-1.5MM  [TEST_PAD-1.5MM]  204.95,5.09 0 bottom
P11  TEST_PADPAD-1.5MM  [TEST_PAD-1.5MM]  217.08,98.31 0 top
P13  TEST_PADPAD-1.5MM  [TEST_PAD-1.5MM]  28.03,17.78 270 top
P14  TEST_PADPAD-1.5MM  [TEST_PAD-1.5MM]  230.36,40.05 0 top
P15  TEST_PADPAD-1.5MM  [TEST_PAD-1.5MM]  230.5,35.64 0 top
P18  TEST_PADPAD-1.5MM  [TEST_PAD-1.5MM]  106.03,52.73 180 top
P19  TEST_PADPAD-1.5MM  [TEST_PAD-1.5MM]  106.06,55.09 0 top
P20  TEST_PADPAD-1.5MM  [TEST_PAD-1.5MM]  133.78,55.45 0 top
P21  TEST_PADPAD-1.5MM  [TEST_PAD-1.5MM]  11.79,129.84 90 top
P25  TEST_PADPAD-1.5MM  [TEST_PAD-1.5MM]  9.29,129.84 90 top
P26  TEST_PADPAD-1.5MM  [TEST_PAD-1.5MM]  232.53,7.69 0 bottom
P28  TEST_PADPAD-1.5MM  [TEST_PAD-1.5MM]  25.81,17.7 270 top
P31  TEST_PADPAD-1.5MM  [TEST_PAD-1.5MM]  6.79,129.84 90 top
P32  TEST_PADPAD-1.5MM  [TEST_PAD-1.5MM]  229.49,7.69 0 bottom
P33  TEST_PADPAD-1.5MM  [TEST_PAD-1.5MM]  213.13,29.47 90 bottom
P34  TEST_PADPAD-1.5MM  [TEST_PAD-1.5MM]  209.54,28.69 90 bottom
P35  TEST_PADPAD-1.5MM  [TEST_PAD-1.5MM]  210.74,30.98 90 bottom
P36  TEST_PADPAD-1.5MM  [TEST_PAD-1.5MM]  14.29,129.84 0 top
P39  TEST_PADPAD-1.5MM  [TEST_PAD-1.5MM]  12.96,112.56 0 top
P40  TEST_PADPAD-1.5MM  [TEST_PAD-1.5MM]  120.44,61.62 0 top
P41  TEST_PADPAD-1.5MM  [TEST_PAD-1.5MM]  114.71,59.13 0 top
P43  TEST_PADPAD-1.5MM  [TEST_PAD-1.5MM]  107.6,41.73 0 top
P44  TEST_PADPAD-1.5MM  [TEST_PAD-1.5MM]  106.84,47.19 0 top
P46  TEST_PADPAD-1.5MM  [TEST_PAD-1.5MM]  111.98,43.74 0 top
P47  TEST_PADPAD-1.5MM  [TEST_PAD-1.5MM]  12.45,17.68 270 top
P51  TEST_PADPAD-1.5MM  [TEST_PAD-1.5MM]  131.63,59.22 0 top
P54  TEST_PADPAD-1.5MM  [TEST_PAD-1.5MM]  37.35,6.75 0 bottom
P55  TEST_PADPAD-1.5MM  [TEST_PAD-1.5MM]  34.44,6.74 0 bottom
P56  TEST_PADPAD-1.5MM  [TEST_PAD-1.5MM]  109.65,52.28 0 top
P63  TEST_PADPAD-1.5MM  [TEST_PAD-1.5MM]  104.19,58.18 180 top
P64  TEST_PADPAD-1.5MM  [TEST_PAD-1.5MM]  112.12,52.69 270 top
P66  TEST_PADPAD-1.5MM  [TEST_PAD-1.5MM]  112.61,55.29 0 top
P67  TEST_PADPAD-1.5MM  [TEST_PAD-1.5MM]  232.83,87.91 0 top
P68  TEST_PADPAD-1.5MM  [TEST_PAD-1.5MM]  129.23,58.41 0 top
P69  TEST_PADPAD-1.5MM  [TEST_PAD-1.5MM]  233.17,57.4 0 top
P70  TEST_PADPAD-1.5MM  [TEST_PAD-1.5MM]  115.4,62.13 0 top
P72  TEST_PADPAD-1.5MM  [TEST_PAD-1.5MM]  23.58,17.7 270 top
P73  TEST_PADPAD-1.5MM  [TEST_PAD-1.5MM]  21.36,17.65 270 top
P77  TEST_PADPAD-1.5MM  [TEST_PAD-1.5MM]  229,57.47 0 top
Q1  BSS138W_SOT323  [MOS_SOT323]  222.06,35.98 270 top
Q2  BSS138W_SOT323  [MOS_SOT323]  227.62,36.01 270 top
Q3  XR65P02D  [PDFN3333]  215.72,84.61 180 top
Q4  BSS138W_SOT323  [MOS_SOT323]  139.28,131.12 270 top
Q5  XR65P02D  [PDFN3333]  214.08,93.59 90 top
Q6  BSS138W_SOT323  [MOS_SOT323]  139.35,135.09 270 top
Q7  BSS138W_SOT323  [MOS_SOT323]  139.52,138.69 270 top
Q8  BSS138W_SOT323  [MOS_SOT323]  100.34,133.04 0 top
Q9  BSS138W_SOT323  [MOS_SOT323]  102.52,133.07 0 top
Q10  AO3401_NC  [PMOS_SOT23]  210.02,35.78 270 top
Q11  AO3401_NC  [PMOS_SOT23]  87.34,60.12 270 top
R1  10K  [R0603@1]  104.11,96.9 0 top
R2  100K  [R0603@1]  104.06,103.08 270 top
R3  5.1K  [R0603@1]  233.42,85.09 0 top
R4  5.1K  [R0603@1]  233.47,79.56 180 top
R5  10K  [R0603@1]  206.96,84.68 90 top
R6  0R  [R0603@1]  233.41,83.27 0 top
R7  0R  [R0603@1]  233.41,81.43 0 top
R8  0R  [R0603@1]  200.67,74.62 90 top
R9  10K  [R0603@1]  202.6,84.73 270 top
R10  0R  [R0603@1]  199.24,74.63 90 top
R11  22.1K  [R0603]  105.56,103.08 90 top
R12  0R  [R0402]  89.89,97.97 0 top
R13  0R  [R0603@1]  103.05,87.82 180 top
R14  NC/499K  [R0603]  104.03,94.16 270 top
R15  10K  [R0402']  12.14,19.63 180 top
R16  2K  [R0603-SP]  170.49,9.56 0 top
R17  5.1K  [R0603@1]  179.2,12.35 0 top
R18  10K  [R0603@1]  219.95,84.62 180 top
R19  0R  [R0402]  77.4,97.83 180 top
R20  0R  [R0402]  75.17,98.04 0 top
R21  NC/499K  [R0603]  105.47,94.14 90 top
R22  4.7K  [R0603@1]  141.86,134.82 90 top
R23  0R  [C0402]  91.6,76.8 270 top
R24  0R  [R0603@1]  108.55,90.49 90 top
R25  0R  [R0603-SP]  105.96,57.79 270 top
R26  5.1K  [R0603@1]  233.91,74.97 180 top
R27  10K  [R0402']  14.3,19.66 180 top
R28  10K  [R0402']  18.68,19.67 180 top
R29  10K  [R0402']  20.84,19.65 180 top
R30  10K  [R0402']  23.03,19.66 180 top
R31  2K  [R0603-SP]  202.59,68.82 180 top
R32  2K  [R0603-SP]  202.53,67.15 180 top
R33  10K  [R0402']  20.84,20.74 180 top
R34  22R  [R0402']  18.53,113.99 270 top
R35  NC/10M  [R0402]  73.55,94.88 90 top
R36  0R  [R0402]  72.68,90.5 90 top
R37  0R  [R0402]  72.26,85.81 90 top
R38  0R  [R0402]  75.12,78.2 180 top
R39  0R  [R0402]  92.99,85.88 270 top
R40  0R_NC  [R0402]  94.85,83.22 90 top
R41  0R  [R0402]  81.06,98.89 180 top
R42  0R  [R0402]  73.01,83.04 270 top
R43  0R  [R0402]  93.21,95.68 90 top
R44  0R  [R0402]  83.02,98.88 0 top
R45  4.7K  [R0603@1]  224.9,36.03 270 top
R46  4.7K  [R0603@1]  231.2,43.1 0 top
R47  5.1K  [R0603@1]  170.49,11.65 180 top
R48  0R  [0402]  207.75,134.26 180 top
R49  0R  [0402]  207.7,143.28 180 top
R50  5.1K  [R0603@1]  179.2,10.96 0 top
R51  4.7K  [R0603@1]  231.08,46.55 0 top
R52  4.7K  [R0603@1]  219.32,36.07 270 top
R53  10K  [R0603@1]  97.73,42.95 90 top
R54  10K  [R0603@1]  9.11,15.54 270 top
R55  0R  [R0603@1]  103.96,79.33 180 top
R56  4.7K  [R0603@1]  137.13,135.06 270 top
R57  4.7K  [R0603@1]  137.08,131.12 270 top
R58  4.7K  [R0603@1]  141.84,131.57 270 top
R59  4.7K  [R0603@1]  141.96,138.68 270 top
R60  0R  [R0603@1]  94.19,89.71 0 top
R61  10K  [R0603@1]  151.31,136.3 0 top
R62  4.7K  [R0603@1]  137.14,138.97 270 top
R63  100K  [R0402]  132.66,57.4 270 top
R64  100K  [R0402]  133.65,57.4 90 top
R65  0R  [R0603@1]  100.97,45.68 180 top
R66  10K  [R0603@1]  151.4,130.61 0 top
R67  10K  [R0603@1]  131.04,131.04 270 top
R68  100K  [R0402]  116.26,59.56 90 top
R69  2K  [R0603-SP]  86.51,100.38 0 top
R70  0R  [R0402]  93.28,93.73 270 top
R71  10K  [R0603@1]  210.05,38.29 0 top
R72  10K  [R0402]  41.39,125.02 180 top
R73  10K  [R0402]  41.39,124.08 180 top
R74  2K  [R0603@1]  97.36,129.82 90 top
R75  2K_NC  [R0603@1]  98.82,129.79 90 top
R76  0R  [R0603@1]  11.97,110.26 270 top
R77  10K  [R0603@1]  13.4,110.26 270 top
R78  4.7K  [R0603@1]  215.36,96.19 0 top
R79  OR  [R0603-SP]  63.9,15.43 0 top
R80  0R  [R0402]  82.41,78.19 0 top
R81  51K  [R0402']  18.09,115.49 0 top
R82  51K  [R0402']  20.17,115.49 0 top
R83  51K  [R0402']  22.25,115.49 0 top
R84  51K  [R0402']  24.34,115.49 0 top
R85  51K  [R0402']  26.42,115.49 0 top
R86  51K  [R0402']  28.5,115.49 0 top
R87  10K  [R0603@1]  16.27,110.26 90 top
R88  0R  [R0402]  59.89,95.89 90 top
R89  0R  [R0402]  58.07,95.89 90 top
R90  0R  [R0402]  58.97,95.89 90 top
R91  10K  [R0603@1]  201.07,84.71 90 top
R92  0R  [R0402]  80.35,75.99 90 top
R93  2K  [R0603@1]  103.29,135.47 180 top
R94  2K  [R0603@1]  99.59,135.48 0 top
R95  0R  [R0402]  78.45,75.99 90 top
R96  5.1K  [R0603@1]  233.98,64.09 0 top
R97  2K  [R0603@1]  103.17,129.81 90 top
R98  2K  [R0603@1]  100.97,129.81 90 top
R99  0R  [R0402]  77.56,75.99 90 top
R100  0R  [R0402]  79.05,78.79 90 top
R101  5.1K  [R0603@1]  234.04,61.07 180 top
R102  0R  [R0402]  79.95,78.79 90 top
R103  0R  [R0603@1]  106.94,94.13 90 top
R104  0R  [R0402]  77.23,78.85 90 top
R105  0R  [R0402]  71.15,82.57 90 top
R106  10K  [R0603@1]  94.19,91.22 180 top
R107  0R_NC  [R0402]  70.2,82.57 90 top
R108  100K  [R0402]  117.23,59.56 270 top
R109  0R  [R0402]  86.11,98.13 0 top
R110  0R  [R0402]  95.92,83.17 90 top
R111  0R  [R0402]  60.28,84.04 180 top
R112  0R_NC  [R0603@1]  72.38,18.39 270 top
R113  0R_NC  [R0603@1]  210.01,29.95 0 top
R114  0R_NC  [R0603@1]  210.01,31.35 0 top
R115  0R_NC  [R0603@1]  210.01,28.55 0 top
R116  10K  [R0603@1]  198.52,54.57 270 top
R117  100K_NC  [R0603@1]  210.04,33.18 180 top
R118  0R  [R0603@1]  188.94,70.74 0 top
R119  0R  [R0603@1]  188.94,69.32 0 top
R120  5.1K_NC  [R0603@1]  202.58,63.94 180 top
R121  5.1K_NC  [R0603@1]  202.56,65.59 180 top
R122  100K  [R0402]  119.28,59.56 90 top
R123  100K  [R0402]  118.31,59.56 270 top
R124  0R  [R0402]  41.39,125.97 180 top
R125  0R  [R0402]  41.39,126.91 180 top
R126  0R  [R0402]  94.83,75.68 0 top
R127  0R_NC  [R0402]  94.87,76.55 0 top
R128  0R  [R0402]  60.28,84.98 180 top
R129  0R_NC  [R0603@1]  73.84,18.39 270 top
R130  0R  [R0402]  60.28,85.87 180 top
R131  10K/NC  [R0402]  9.08,135.52 0 top
R132  OR/NC  [R0402]  9.08,134.55 180 top
R133  22R  [R0402']  20.61,113.99 270 top
R134  OR/NC  [R0402]  9.1,132.72 0 top
R135  22R  [R0402']  22.69,113.99 270 top
R136  22R  [R0402']  24.77,113.99 270 top
R137  22R  [R0402']  26.85,113.99 270 top
R138  22R  [R0402']  28.92,113.99 270 top
R139  100K_NC  [R0603@1]  70.78,18.34 90 top
R140  10K  [R0402']  16.49,19.67 180 top
R141  OR  [R0402]  9.08,138.39 0 top
R142  OR  [R0402]  9.08,139.39 0 top
R143  50K_NC  [R0603-SP]  76.8,18.39 270 top
R144  OR  [R0402]  9.1,133.62 180 top
R145  OR  [R0402]  9.08,137.43 0 top
R146  0R  [R0402]  33.88,115.23 180 top
R147  OR  [R0603-SP]  52.3,15.03 0 top
R148  0R  [R0402]  33.88,116.15 180 top
R149  0R_NC  [R0603@1]  75.35,18.39 270 top
R151  0R  [0402]  207.76,140.43 180 top
R152  100R  [R0402]  83.59,76.01 270 top
R153  100R  [R0402]  84.44,76.01 270 top
R154  100R  [R0402]  86.37,76.01 270 top
R155  100R  [R0402]  87.26,76.01 270 top
R156  100R  [R0402]  85.8,78.71 270 top
R157  100R  [R0402]  84.9,78.71 270 top
R158  4.02K  [R0402]  87.8,78.71 270 top
R159  0.75R  [R0603-SP]  99.93,63.07 90 top
R160  10K  [R0603@1]  96.33,64.04 0 top
R161  0R_NC  [R0402]  37.17,130.71 270 top
R162  0R_NC  [R0402]  36.68,132.15 180 top
R163  NC  [R0603-SP]  101.33,63.07 90 top
R164  0R  [R0603@1]  165.41,10.48 90 top
R165  100K  [R0603@1]  85.28,46.96 180 top
R166  210K  [R0603]  85.11,54.34 90 top
R167  12K  [R0603]  83.68,54.33 270 top
R168  1.5K  [R0402]  120.34,59.55 270 top
R169  1K  [R0402]  123.18,59.55 270 top
R170  0R  [R0402]  40.77,118.71 0 top
R171  10K/NC  [R0402]  9.08,136.47 0 top
R172  220R  [R0603]  97.63,53.7 90 top
R173  51K  [R0603@1]  101.29,53.7 270 top
R174  220R  [R0603]  97.47,49.19 90 top
R175  51K  [R0603@1]  101.29,49.19 270 top
R177  0R  [R0402]  40.77,119.67 0 top
R178  20K  [R0603]  63.85,9.23 0 top
R179  20K  [R0603]  52.3,9.23 180 top
R180  10K  [R0603@1]  84.81,60.12 270 top
R181  10K  [R0603@1]  61.37,130.41 270 top
R182  0R  [R0805]  31.54,130.86 180 top
R184  0R  [R0603@1]  89.92,60.12 90 top
R185  OR  [R0603-SP]  52.3,6.13 0 top
R186  0R  [R0603@1]  163.29,10.42 90 top
R187  39k  [R0603@1]  202.55,59.21 180 top
R188  100k  [R0603@1]  202.52,62.42 0 top
R189  39k  [R0603@1]  188.91,66.27 0 top
R190  0R  [R0402]  81.24,75.99 90 top
R191  0R  [R0402']  14.76,22.3 90 top
R192  0R  [R0402']  16.87,22.24 90 top
R193  0R  [R0402']  19.13,22.27 90 top
R194  0R  [0402]  207.71,142.06 180 top
R210  NC/10K  [R0603@1]  106.01,87.82 180 top
R216  0R  [0402]  207.74,135.64 0 top
R217  0R  [0402]  207.75,138.73 0 top
R332  0R  [0402]  207.74,137.41 0 top
R333  10K  [R0402]  65.66,82.57 90 top
SW1  switch_6pin  [SWITCH_6PIN_2P]  242.35,100.92 90 top
U1  CH340K  [ESOP-10-EP-150MIL]  204.9,79.75 180 top
U2  TP4059-SOT23-6  [SOT23-6L]  174.87,11.72 90 top
U3  NS4168-NC  [NS4168-ESOP-8]  218.1,28.57 270 top
U4  NS4263B  [SOP16]  55.35,15.33 270 top
U5  STC8H1K08-36I  [TSSOP20]  196.13,67.06 0 top
U6  MT9201  [COOPER_SOT23-6]  96.33,61.53 90 top
U7  ESP32-P4NRW32  [IC_ESP32-P4NRW32]  81.86,88.68 0 top
U8  UMH3NTN  [SOP65P210X100-6N]  204.82,84.75 90 top
U9  RY3420/C370754  [SOT95P280X145-5N]  104.17,99.42 0 top
U10  MT3406_C22462728  [SOT95P280X145-5N]  104.03,90.52 0 top
U13  NS4168-NC  [NS4168-ESOP-8]  73.41,12.25 270 top
U16  MT3608  [SOT95P280X145-6N]  85.31,49.91 270 top
U176  [BRAIN1_MIC-SMD_5P-L3.5-W2.7]  3.08,135.12 270 top
Y2  40MHZ  [X322540MPB4SI]  77.46,101.64 0 top
Y3  24Mhz  [24MHZ_1631-24003-BTKEYA]  128.12,130.95 180 top
Y4  32.768K  [NORDIC_NRF_XTAL_3215_N]  70.98,95.14 270 top

## Tracks (layer width: path | path; a pad name or v marks a point on that pad's centre or on a via)
3V3$
  Top 0.2: C2.2 202.2,75.52 U1.10
11
  cutout Top: 117.36,137.43 117.36,135.62 117.33,135.59 128.55,135.59 128.55,137.54 117.44,137.54 117.33,137.43
12
  cutout Top: 116.1,55.91 116.1,54.03 116.27,53.87 131.16,53.87 131.21,53.92 131.21,55.79 131.16,55.85 116.1,55.85
+5V_IN  (1 unrouted)
  Top 0.61: D2.+ 221.2,91 D4.+
  Top 1: J10.3 241.08,40.07 | R46.1 230.44,46.42 R51.1 224.57,46.55 224.2,46.92
  Top 1.5: D2.+ 221.66,90.16 224.2,87.61 224.2,46.92 224.2,44.41 228.54,40.07 J10.3
+VBUS1  (via drill 0.35)  (2 unrouted)
  Top 0.12: 239.82,81.53 239.97,81.68 J1.A4
  Top 0.152: D11.+
  Top 0.3: 239.8,86.33 J1.A9 | J1.A9 240.11,86.36 | 238.15,81.53 237.95,81.33 | J1.A4 240.12,81.56 J1.B9 239.97,81.68 | J1.A9 240.05,86.42 240.05,86.28
  Top 0.5: 242.16,85.16 240.96,86.36 240.11,86.36 239.83,86.36 239.8,86.33 | 242.16,82.76 240.96,81.56 240.12,81.56 | D11.+ 221.2,85.99 v221.54,85.65 | 229.46,87.6 P1.P$1 | 239.82,86.35 229.48,86.35 229.46,86.37
  Top 0.6: 242.16,85.16 242.16,82.76 | 239.82,81.53 238.15,81.53
  Top 1: D10.+ 221.72,96.75 | 232.64,77.79 232.67,77.82 | P1.P$1 v229.49,85.68
  Top 1.5: 221.72,96.75 224.07,96.75 229.46,91.35 229.46,86.37 229.46,79.31 230.98,77.79 232.64,77.79 | 237.95,81.33 237.95,79.3 236.47,77.82 232.67,77.82
  Bottom 0.3: v229.49,85.68 229.46,85.65 v229.46,86.31
  Bottom 0.5: v221.54,85.65 229.46,85.65
+VBUS2
  Top 0.12: 238.14,65.57 237.84,65.27 | 240.09,60.63 J16.B9 | J16.A9 239.2,65.57 | J16.A9 J16.B4 | J16.A9 240.08,65.44 240.93,65.44
  Top 0.152: 239.91,60.66 239.94,60.63
  Top 0.3: J16.B4 237.84,65.27 | 239.2,65.57 238.14,65.57 | J16.B9 239.94,60.63 J16.A4
  Top 0.5: 240.09,60.63 240.91,60.63 242.28,62 242.28,64.09 240.93,65.44 | 228.63,58.58 228.7,58.51 228.7,57.77 P77.P$1
  Top 0.6: 238.49,60.66 239.91,60.66
  Top 0.61: D007.+ 220.2,92.17 220.2,88.33 220.48,88.05 D008.+
  Top 1: 238.14,65.57 227.16,65.57 227.1,65.57 | D007.+ | 237.38,59.55 238.49,60.66 | 228.64,58.1 228.64,57.83 P77.P$1
  Top 1.5: 227.1,65.57 227.1,89.44 222.91,93.63 D007.+ | 227.16,65.57 227.16,61.35 228.63,59.88 | 228.63,59.88 228.96,59.55 237.38,59.55 | 228.63,59.88 228.63,58.58 228.63,58.05
ADC_AVDD_3V3
  Top 0.203: IC5.22 34.19,125.86 33.96,125.63 | IC5.23 34.23,125.46 34.06,125.63
  Top 0.508: FB5.2 32.51,124.23 C133.2 C132.1 33.59,125.16 34.06,125.63 33.96,125.63
ADC_DVDD_3V3  (via drill 0.3 pad 0.6)
  Top 0.25: IC5.7 39.6,127.46 39.76,127.3 | IC5.6 38.96,127.08 39.43,127.08 39.65,127.3
  Top 0.254: C130.1 41.29,128.09 41.29,128.04 41.5,127.83 42.24,127.83 42.25,127.83 43.06,127.83 43.63,127.26 43.63,124.72 v43.42,124.51 | R73.1 41.83,124.07 v41.83,123.17
  Top 0.406: FB4.2 C131.2 40.98,128.42 C130.1 40.87,128.41 39.76,127.3 39.65,127.3
  Bottom 0.254: v43.42,124.51 43.42,123.85 42.75,123.17
  Bottom 0.305: 42.75,123.17 v41.83,123.17
ADC_VBAT
  Top 0.3: U5.13 200.27,64.84 200.96,64.15 200.96,63.03 201.79,62.2 R187.2 201.73,59.26 C161.2 201.76,60.83 R188.1
AGND  (via drill 0.3 pad 0.6)
  Top 0.12: v47.33,9.86 46.33,9.86 v46.3,9.83 | J4.P$4 39.18,9.14 | J4.P$3 39.71,9.14
  Top 0.508: v46.3,9.83 45.62,9.14 39.71,9.14 39.18,9.14
  other vias: 51.45,5.13 56.95,7.43 64.75,5.13 62.15,13.93 54.05,13.93 54.41,16.96 54.45,18.83 65.85,15.43 72.25,12.93 73.35,12.93 74.55,12.93 72.25,12.03 73.45,12.03 74.55,12.03 67.65,16.13 74.05,8.13 72.45,8.13 73.25,8.13 69.25,20.13 62.45,20.33 60.95,20.33 59.65,20.43 54.51,19.86 54.49,17.88 54.05,7.23 56.85,14.13 77.93,19.28 77.55,10.83 67.65,12.53 69.82,10.95 70.75,2.83 74.95,4.13 77.48,5.38 56.41,19.86 56.21,16.66 41.27,3.23
  pour Top (no thermals): 31.82,11.07 46.16,11.07 50.9,15.81 52.1,15.81 52.64,16.35 52.64,20.37 53.18,20.91 77.93,20.91 78.41,20.43 78.41,3.06 77.51,2.16 32.36,2.16 31.31,3.21 31.31,10.56
  pour Bottom (no thermals): 31.79,11.07 46.13,11.07 50.87,15.81 52.07,15.81 52.61,16.35 52.61,20.37 53.15,20.91 77.9,20.91 78.38,20.43 78.38,3.06 77.48,2.16 32.33,2.16 31.28,3.21 31.28,10.56
AGND1  (via drill 0.3 pad 0.6, 0.35 pad 0.6)
  Top 0.102: v2.35,136.49 2.35,136.17 2.53,136 2.53,135.93
  Top 0.12: R145.2 10.31,137.43 v10.32,137.42 | 33.48,126.26 v33.36,126.13 | 2.93,135.01 2.93,134.86 | IC6.10 40.01,116.26 39.93,116.34
  Top 0.152: 29.21,128.93 C128.2 30.66,129.92 R182.2
  Top 0.2: IC5.21 33.48,126.26 | 39.93,116.34 38.77,116.34 v38.73,116.38
  Top 0.5: v2.35,136.49 2.37,136.47 U176.P$1 2.37,133.86 v2.35,133.84
  other vias: 4.57,139.13 10.34,136.5 30.66,124.38 30.66,125.28 30.66,127.78 30.11,128.44 34.83,118.78 33.53,117.18 33.53,114.28 37.93,111.72 35.03,114.18 35.03,113.28 46.13,114.38 46.13,115.98 33.36,120.58 34.46,120.58 35.66,120.58 36.76,120.58 38.06,120.58 5.3,133.47 30.86,122.58 10.38,133.57 13.16,134.19 14.04,136.26 22.87,131.2 29.35,131.34 29.31,130.42 30.34,132.1 24.11,128.6 25.97,128.66 33.67,110.55 38.9,110.55 43.78,111.01 45.66,112.1 45.28,114.32 31.53,116.98 31.52,112.94
  pour Top (no thermals): 1.47,140.46 12.5,140.46 20.56,132.4 30.59,132.4 31.05,131.94 31.05,130.32 33.8,127.57 33.8,122.7 34.66,121.84 40.97,121.84 41.02,121.89 41.02,117.81 39.03,115.82 39.03,111.67 39.64,111.06 42.77,111.06 44.83,113.12 44.83,116.31 44.93,116.41 46.31,116.41 46.5,116.22 46.5,112.02 44.31,109.83 32.22,109.83 31.26,110.79 31.26,119.14 19.03,131.37 7.11,131.37 5.56,132.92 1.84,132.92 1.02,133.74 1.02,140.01
  pour Bottom (no thermals): 1.49,140.45 12.52,140.45 20.58,132.39 30.61,132.39 31.07,131.93 31.07,130.31 33.85,127.53 33.85,122.69 34.71,121.83 40.99,121.83 41.04,121.88 41.04,117.8 39.05,115.81 39.05,111.66 39.66,111.05 42.79,111.05 44.85,113.11 44.85,116.3 44.95,116.4 46.33,116.4 46.52,116.21 46.52,112.01 44.33,109.82 32.24,109.82 31.28,110.78 31.28,119.17 19.09,131.36 7.13,131.36 5.57,132.92 1.85,132.92 1.04,133.73 1.04,140
AGND2  (via drill 0.35 pad 0.6)
  other vias: 240.91,132.96
AGND3  (via drill 0.35 pad 0.6)
  Top 0.102: FB20.2 222.44,23.47 222.44,24.47 222.41,24.5
  Top 0.12: 218.74,28.27 218.44,28.57 U3.9 217.73,28.57 v217.33,28.97 | FB20.2 222.44,24.47 222.41,24.5 | 217.67,23.41 C68.1 | 218.82,24.22 218.74,24.22 | C24.2 212.86,26.67 v213.15,26.96
  Top 0.3: C22.2 C23.2 C24.2 | 216.04,28.64 218.04,28.64 U3.9 | 218.74,28.47 218.74,28.27 U3.7 218.74,24.22 218.74,23.37 218.72,23.36 | 218.74,28.47 218.74,28.85 v218.86,28.97 | C68.1 218.72,23.36 | 218.72,23.36 C67.1 | 222.38,24.47 222.41,24.5 222.41,27.3 222.47,27.35 222.49,27.38 221.31,28.57 220.85,29.03 219.3,29.03 218.74,28.47
  Top 1: C22.2 C24.2 212.86,27.14 214.36,28.64 216.04,28.64 219.78,28.64 221.24,28.64 221.31,28.57 222.41,27.46 222.41,27.3 | 222.47,27.35 222.47,23.49
  Bottom 0.12: v218.86,28.97 v218.86,28.08 | v218.86,28.08 | v217.33,28.97 217.33,28.11 v217.38,28.05 217.41,28.08 v218.86,28.08
AUDIO_CTRL  (via drill 0.35)
  Top 0.152: v205.73,25.63 206.88,26.78 206.88,32.74 207.35,33.22 209.24,33.22 R117.2
  Top 0.2: R139.2 70.78,19.66 v71.35,20.23
  Top 0.5: R117.2 211.04,34.93 Q10.3
  Bottom 0.152: v205.73,25.63 205.72,25.62 128.67,25.62 117.61,14.56 114.94,14.56 114.75,14.75 83.74,14.75 78.27,20.23 v71.35,20.23
AUDIO_OUT_3V3  (via drill 0.3 pad 0.6)
  Top 0.61: FB15.2 62.52,17.66 C148.2 62.48,17.66 C134.2 C154.1 58.95,17.01 58.95,12.03 v59.15,11.83 59.46,11.52 U4.13 | U4.4 v56.75,11.53
  Bottom 0.61: v56.75,11.53 58.85,11.53 v59.15,11.83
AUDIO_OUT_SD  (via drill 0.3, 0.35)
  Top 0.12: R147.1 51.54,15.12 52.45,16.03 54.35,16.03 55.36,17.04 55.36,22.62 56.66,23.92 v56.74,23.92 | Q10.1 206.3,36.67 205.37,35.73 v205.37,35.59 | 88,86.75 88.07,86.69 88.09,86.69 88.53,86.24 88.53,83.36 92.88,79.01 96.29,79.01 97.94,77.35 129.78,77.35 135.1,72.03 135.1,61.65 138.83,57.92 138.83,49.18 139.74,48.26
  Top 0.152: 139.74,48.26 v139.74,35.35 | U7.60 88,86.75
  Top 0.5: R71.1 209.29,36.95 Q10.1
  Bottom 0.152: 205.16,35.39 139.78,35.39 v139.74,35.35 139.7,35.31 111.96,35.31 98.94,22.29 83.85,22.29 75.49,30.66 72.26,30.66 71.87,30.27 71.87,26.26 70.28,24.67 57.49,24.67 v56.74,23.92
  Bottom 0.3: 205.16,35.39 v205.37,35.59
AUDIO_VDD1
  Top 0.508: FB17.1 C104.1 69.28,17.52 C102.1 C103.1 70.85,12.02 70.85,11.33 71.45,10.73 71.95,10.73 72.78,9.9 U13.6
AUDIO_VDD2
  Top 0.508: FB18.1 C22.1 C23.1 C24.1 214.39,26.12 215.31,27.05 217.01,27.05 217.47,26.59 U3.6
AUDIO_VDD_3V3  (via drill 0.3, 0.35, 0.4)
  Top 0.12: 56.8,129.66 IC7.5
  Top 0.4: v8.39,132.01 8.01,132.01 FB6.1 | FB5.1 30.29,123.35 26.77,126.86 v26.77,129.46
  Top 0.5: 45.95,127.23 45.95,119.21 45.21,118.46 FB14.1
  Top 0.61: FB4.1 41.91,130.32 42.28,130.32 43.09,129.5 v43.12,129.5 43.68,129.5 45.95,127.23
  Top 1: FB16.2 C153.2 C152.2 56.8,129.66 | 50.94,129.55 50.06,129.55 v50.01,129.5 52.19,129.5 FB16.2 | FB16.2 52.35,129.57
  Bottom 0.4: v43.12,129.5 43.08,129.46 v26.77,129.46 22.12,129.46 19.57,132.01 v8.39,132.01
  Bottom 1: v50.01,129.5 v50,129.5 v43.12,129.5
AVDD_2V8  (via drill 0.35)
  Top 0.5: v143.5,132.43 143.53,132.45 v144.25,132.45 144.72,132.45
  Top 0.61: IC3.5 146.9,132.27 C82.2 C83.2 144.72,132.45
  Bottom 0.5: v144.25,132.45 143.53,132.45 v143.5,132.43 140.65,132.43 136.38,136.7 130.43,136.7 130.23,136.9 | 130.23,136.9 v130.2,136.93 | 130.23,136.9 130.23,136.26 v130.2,136.23
  pour Top: 128.75,137.43 128.75,135.78 128.8,135.73 128.95,135.58 130.55,135.58 130.65,135.68 130.65,136.48 130.65,137.38 130.55,137.48 128.8,137.48
C6_EN  (via drill 0.3)
  Top 0.12: U7.63 87.81,87.8 88.02,88.02 88.55,88.02 89.07,87.5 89.07,83.54 92.96,79.64 96.8,79.64 v98.37,78.08 | R77.1 13.39,111.03 13.39,111.07 12.96,111.5 P39.P$1 12.96,112.58 12.63,112.9 IC1.8 | v59.6,76.07 59.59,76.08 59.59,82.17 56.91,84.85 50.79,84.85 49.77,83.83 47.63,83.83 45.04,86.42 40.28,86.42 18.75,107.95 16,107.95 15.56,108.39 15.56,110.29 C15.1
  Top 0.15: R77.1 C15.1
  Bottom 0.12: v59.6,76.07 59.79,75.88 81.69,75.88 82.44,75.13 95.42,75.13 v98.37,78.08
C6_IO8
  Top 0.12: IC1.22 16.67,123.45 16.79,123.33
  Top 0.15: R87.2 16.79,111.55 16.79,123.33
C6_IO9_BOOT  (via drill 0.3)
  Top 0.15: IC1.23 15.2,124.25 v14.93,124.52 | v13.07,129.72 13.2,129.84 P36.P$1
  Bottom 0.15: v14.93,124.52 12.8,126.65 12.8,129.45 v13.07,129.72
C6_RXD0
  Top 0.12: IC1.30 11.03,126.84
  Top 0.15: IC1.30 11.03,129.08 P21.P$1
C6_TXD0
  Top 0.15: P25.P$1 10.23,128.9 IC1.31
C6_VDD_3V3  (via drill 0.3, 0.35)  (1 unrouted)
  Top 0.2: R81.1 v17.65,114.7 v17.63,114.69 | R82.1 v19.73,114.76 v19.73,114.75 | R83.1 21.81,114.77 v21.83,114.75 | R84.1 23.89,114.77 v23.87,114.75 | R85.1 v25.97,114.75 | R86.1 28.06,114.79 v28.04,114.78
  Top 0.3: v16.3,108.54 16.3,109.46 R87.1
  Top 0.4: 8.63,113.28 IC1.3 | R76.1 11.97,110.93 R77.2 13.55,109.35 13.55,108.45 14.09,107.91 v14.96,107.91 | 16.27,109.21 R87.1
  Top 1: R76.1 C11.1 8.63,111.49 8.63,113.28
  Bottom 0.3: v28.04,114.78 26,114.78 v25.97,114.75 v23.87,114.75 v21.83,114.75 v19.73,114.75 17.69,114.75 v17.63,114.69 17.54,114.69 17.16,114.31 17.16,109.4 v16.3,108.54 15.67,107.91 v14.96,107.91
CODEC_3V3  (via drill 0.3 pad 0.6)
  Top 0.2: IC6.4 43.21,114.96 v43.21,114.93 42.85,114.56 IC6.3 | FB13.2 35.94,118.25 36.33,118.64 37.32,118.64 38.65,117.31 41.95,117.31 v42.17,117.53
  Top 0.406: FB14.2 | FB14.2 C145.1 44.32,115.16 C146.2 44.12,114.93 v43.21,114.93 | v43.21,114.93
  Bottom 0.2: v43.21,114.93 43.18,114.93 43.18,116.48 42.17,117.5 v42.17,117.53
CSI_CLK_N  (via drill 0.3)
  Top 0.12: FPC1.19 120.34,135.75 120.49,135.6 120.49,84.74 v120.29,84.54 | R156.2 85.8,78.23 85.49,77.92 85.49,73.31 87.36,71.44 100.74,71.44 v100.95,71.65 v100.95,71.66
  Bottom 0.12: v120.29,84.54 120.32,84.54 120.5,84.36 120.5,84.12 107.8,71.42 101.19,71.42 v100.95,71.66
CSI_CLK_P  (via drill 0.3)
  Top 0.12: FPC1.18 120.84,135.77 120.72,135.65 120.72,84.74 v120.92,84.54 | R157.2 84.93,78.24 84.93,78.19 85.25,77.87 85.25,73.23 87.27,71.22 100.74,71.22 v100.95,71
  Bottom 0.12: v120.92,84.54 120.74,84.36 120.74,84.04 107.9,71.19 101.15,71.19 v100.95,71
CSI_D0_N  (via drill 0.3)
  Top 0.12: FPC1.16 121.84,135.77 121.96,135.65 121.96,85.43 v121.79,85.25 | R152.2 83.93,75.23 83.93,73.35 83.95,73.33 83.95,73.08 87.14,69.89 103.84,69.89 v104.04,69.68
  Bottom 0.12: v104.04,69.68 104.01,69.68 103.81,69.89 103.62,69.89 103.45,69.72 103.45,69.47 103.69,69.22 108.01,69.22 121.99,83.21 121.99,85.04 v121.79,85.25
CSI_D0_P  (via drill 0.3)
  Top 0.12: FPC1.15 122.34,135.8 122.22,135.68 122.22,85.49 v122.45,85.26 | R153.2 84.44,75.42 84.17,75.15 84.17,73.17 87.23,70.11 103.79,70.11 v104.03,70.35
  Bottom 0.12: v104.03,70.35 103.79,70.11 103.49,70.11 103.22,69.84 103.22,69.36 103.58,69 108.14,69 122.21,83.07 122.21,85.02 v122.45,85.26
CSI_D1_N  (via drill 0.3)
  Top 0.12: FPC1.22 118.84,135.76 118.96,135.64 118.96,85.49 118.76,85.28 v118.76,85.26 | R154.2 86.71,75.23 86.71,73.44 87.26,72.89 103.69,72.89 103.85,72.73 v103.91,72.73
  Bottom 0.12: v103.91,72.73 103.75,72.88 103.45,72.88 103.3,72.73 103.3,72.47 103.48,72.28 106.49,72.28 118.94,84.73 118.94,85.07 v118.76,85.26
CSI_D1_P  (via drill 0.3)
  Top 0.12: FPC1.21 119.34,135.76 119.19,135.61 119.19,85.47 v119.41,85.26 | R155.2 86.96,75.27 86.96,73.5 87.35,73.11 103.63,73.11 v103.88,73.37
  Bottom 0.12: v103.88,73.37 103.63,73.11 103.34,73.11 103.07,72.84 103.07,72.33 103.34,72.06 106.58,72.06 119.18,84.66 119.18,85.04 v119.4,85.26 v119.41,85.26
CSI_RESET  (via drill 0.3)
  Top 0.12: R57.2 137.2,130.48 137.31,130.48
  Top 0.15: 137.31,130.48 Q4.2 138.49,130.48 v139.19,131.19 | FPC1.8 125.84,135.41 127.03,134.23 135.42,134.23 136.77,132.87 v138.7,132.87
  Bottom 0.15: v138.7,132.87 139.22,132.35 139.22,131.22 v139.19,131.19
CSI_SCL
  Top 0.12: 137.29,138.05 R62.2
  Top 0.15: Q7.2 138.48,138.21 R62.2 136.28,137.35 136.28,135.64 135.61,134.97 128.12,134.97 127.84,135.25 FPC1.4
CSI_SDA
  Top 0.12: R56.2 137.29,134.46 Q6.2
  Top 0.15: FPC1.5 127.34,135.21 127.87,134.69 135.82,134.69 135.83,134.69 136.74,134.69 R56.2
CSID0_P
  Top 0.12: R153.1 84.44,76.54 84.14,76.84 84.14,81.35 83.09,82.41 U7.43
DA1  (1 unrouted)
  Top 0.12: R15.1 12.58,17.45 13.64,16.4 J5.8
DA2
  Top 0.12: R30.1 23.58,19.55 P72.P$1 23.47,17.7 21.34,15.56 J5.1
DOVDD_1V8  (1 unrouted)
  Top 0.12: R56.1 138.36,135.82 Q6.1 | 138.4,131.75 Q4.1 | 137.55,139.32 R62.1
  Top 0.2: Q6.1
  Top 0.25: C84.2 133.88,129.4 | 125.38,136.57 125.38,134.9
  Top 0.3: 125.38,134.9 125.34,134.93 FPC1.9 125.36,136.58 125.36,137.37
  Top 0.305: 137.2,131.75 R57.1
  Top 0.4: 125.38,134.9 126.46,133.82 133.98,133.82 136.1,131.7 136.1,130.18 135.29,129.36
  Top 0.5: Q7.1 137.55,139.32 | Y3.4 130.06,129.23 131.04,129.23 | 131.04,129.23 133.07,129.23 133.21,129.36 C84.2 135.29,129.36 | R67.2 131.04,129.23 | R57.1 136.9,131.7 136.1,131.7 | 144.42,138.15 143.76,138.81 143.76,139.61 142.85,140.52 139.83,140.52 Q7.1 | Q7.1 138.63,139.28 139.39,138.53 139.39,135.73 Q6.1 | 138.4,131.75 138.88,131.75 139.38,132.26 139.38,135.71 139.37,135.73 Q6.1 | Q4.1 137.2,131.75
  Top 0.61: IC2.5 146.99,137.97 C77.2 C78.2 144.42,138.15
DOWNLOAD_BOOT
  Top 0.152: R106.2
  Top 0.5: R60.1 R106.2
DSI_CLK_N  (via drill 0.2)